# EAGLE schematic 74hct125 (EAGLE 9.3.0)
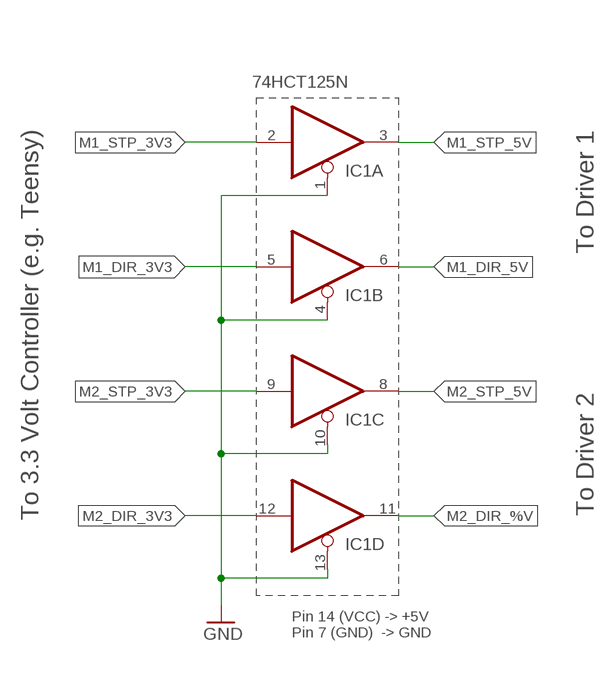
[diagram p0: schematic, sheet 1]

## Parts
IC1  74HCT125N  74AC125N  [DIL14]

## Nets
GND: IC1.1(A:OE) IC1.4(B:OE) IC1.10(C:OE) IC1.13(D:OE)
M1_DIR_3V3: IC1.5(B:I)
M1_DIR_5V: IC1.6(B:O)
M1_STP_3V3: IC1.2(A:I)
M1_STP_5V: IC1.3(A:O)
M2_DIR_3V3: IC1.12(D:I)
M2_DIR_%V: IC1.11(D:O)
M2_STP_3V3: IC1.9(C:I)
M2_STP_5V: IC1.8(C:O)

## Notes on the sheet
- To Driver 1
- To 3.3 Volt Controller (e.g. Teensy) | To Driver 2
- Pin 14 (VCC) -> +5V
  Pin 7 (GND)  -> GND

## Power pins joined to a net without a drawn wire
GND: IC1.7(P:GND)
VCC: IC1.14(P:VCC)

## Library data of the parts
IC1 = 74xx-eu:74*125: Quad bus BUFFER, 3-state